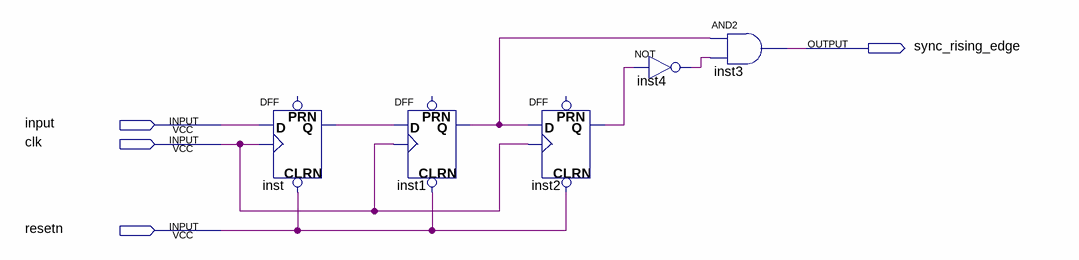
[diagram p0: schematic sheet]
// Quartus schematic input_sync.bdf as structural Verilog: 5 symbols, 4 pins
module input_sync (
  input  \input ,
  input  clk,
  input  resetn,
  output sync_rising_edge
);

  wire inst1_q, inst2_q, inst4_out, inst_q;

  DFF inst (.CLRN(resetn), .CLK(clk), .D(\input ), .Q(inst_q));  // open: PRN
  DFF inst1 (.CLRN(resetn), .CLK(clk), .D(inst_q), .Q(inst1_q));  // open: PRN
  DFF inst2 (.CLRN(resetn), .CLK(clk), .D(inst1_q), .Q(inst2_q));  // open: PRN
  not inst4 (inst4_out, inst2_q);
  and inst3 (sync_rising_edge, inst1_q, inst4_out);
endmodule
